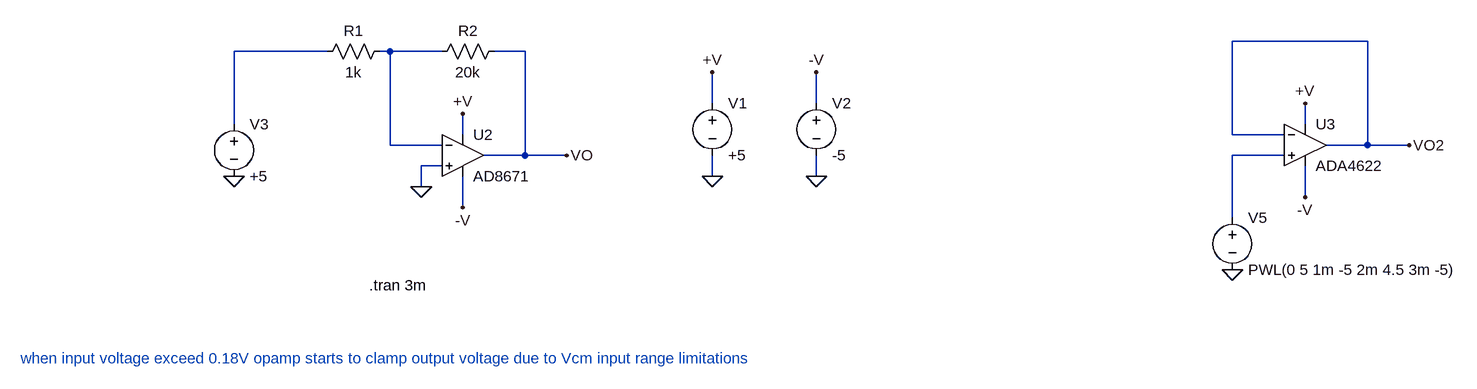
[diagram p0: schematic VcmAnalysis.asc]
VcmAnalysis.asc, the LTspice schematic file:
Version 4
SHEET 1 1796 680
WIRE 1568 -32 1360 -32
WIRE -32 -16 -176 -16
WIRE 64 -16 48 -16
WIRE 144 -16 64 -16
WIRE 272 -16 224 -16
WIRE 560 64 560 16
WIRE 720 64 720 16
WIRE -176 96 -176 -16
WIRE 1472 96 1472 64
WIRE 176 112 176 80
WIRE 1360 112 1360 -32
WIRE 1440 112 1360 112
WIRE 64 128 64 -16
WIRE 144 128 64 128
WIRE 1568 128 1568 -32
WIRE 1568 128 1504 128
WIRE 1632 128 1568 128
WIRE 272 144 272 -16
WIRE 272 144 208 144
WIRE 336 144 272 144
WIRE 1440 144 1360 144
WIRE 144 160 112 160
WIRE 560 176 560 144
WIRE 720 176 720 144
WIRE 112 192 112 160
WIRE 1472 208 1472 160
WIRE 176 224 176 176
WIRE 1360 240 1360 144
FLAG 560 16 +V
FLAG 720 16 -V
FLAG 560 176 0
FLAG 720 176 0
FLAG 176 224 -V
FLAG 176 80 +V
FLAG 336 144 VO
FLAG 112 192 0
FLAG -176 176 0
FLAG 1472 208 -V
FLAG 1472 64 +V
FLAG 1632 128 VO2
FLAG 1360 320 0
SYMBOL voltage 560 48 R0
WINDOW 123 0 0 Left 0
WINDOW 39 0 0 Left 0
SYMATTR InstName V1
SYMATTR Value +5
SYMBOL voltage 720 48 R0
WINDOW 123 0 0 Left 0
WINDOW 39 0 0 Left 0
SYMATTR InstName V2
SYMATTR Value -5
SYMBOL res 64 -32 R90
WINDOW 0 0 56 VBottom 2
WINDOW 3 32 56 VTop 2
SYMATTR InstName R1
SYMATTR Value 1k
SYMBOL res 240 -32 R90
WINDOW 0 0 56 VBottom 2
WINDOW 3 32 56 VTop 2
SYMATTR InstName R2
SYMATTR Value 20k
SYMBOL Opamps\\AD8671 176 80 R0
SYMATTR InstName U2
SYMBOL voltage 1360 224 R0
WINDOW 123 0 0 Left 0
WINDOW 39 0 0 Left 0
SYMATTR InstName V5
SYMATTR Value PWL(0 5 1m -5 2m 4.5 3m -5)
SYMBOL Opamps\\ADA4622 1472 64 R0
SYMATTR InstName U3
SYMBOL voltage -176 80 R0
WINDOW 123 0 0 Left 0
WINDOW 39 0 0 Left 0
SYMATTR InstName V3
SYMATTR Value +5
TEXT 32 344 Left 2 !.tran 3m
TEXT -504 456 Left 2 ;when input voltage exceed 0.18V opamp starts to clamp output voltage due to Vcm input range limitations

The netlist it stands for:
* VcmAnalysis.asc
V1 +V 0 +5
V2 -V 0 -5
R1 N002 N001 1k
R2 VO N002 20k
XU2 0 N002 +V -V VO AD8671  ; pins In+ In- V+ V- OUT
V5 N003 0 PWL(0 5 1m -5 2m 4.5 3m -5)
XU3 N003 VO2 +V -V VO2 ADA4622  ; pins In+ In- V+ V- OUT
V3 N001 0 +5
.tran 3m
* when input voltage exceed 0.18V opamp starts to clamp output voltage due to Vcm input range limitations
.lib ADA4622.lib
.backanno
.end